# Altium schematic sheet GSM.SchDoc
size A3
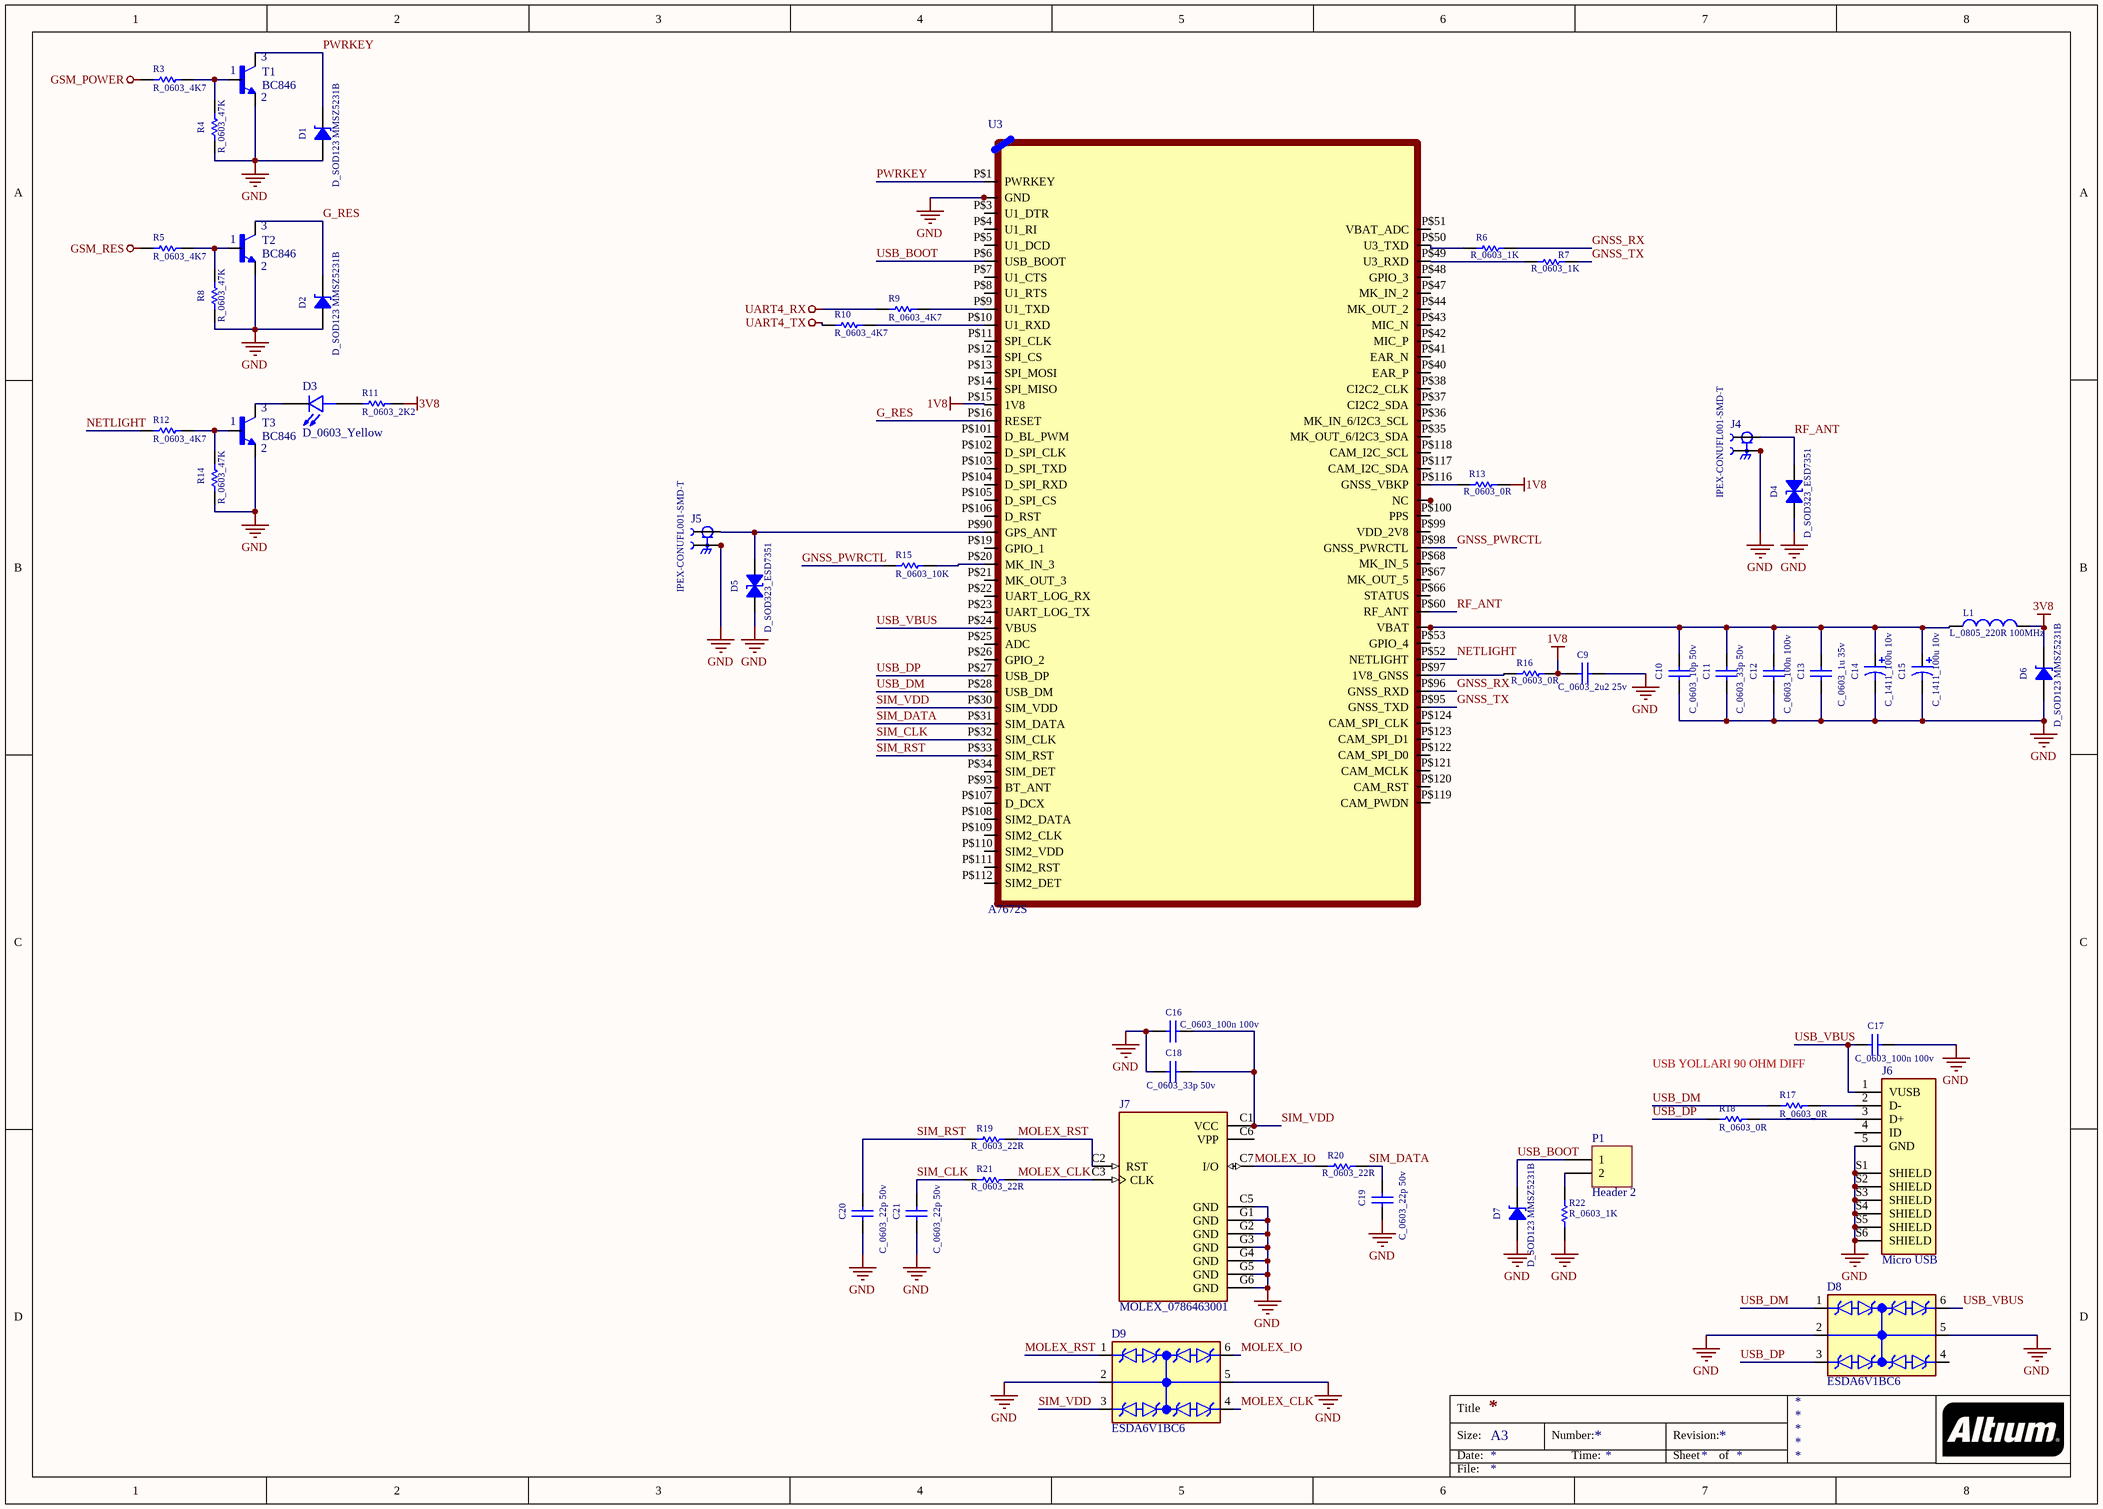
[diagram p0: GSM.SchDoc]

## Parts
C9  C_0603_2u2 25v  [CAP 0603]
C10  C_0603_10p 50v  [CAP 0603]
C11  C_0603_33p 50v  [CAP 0603]
C12  C_0603_100n 100v  [CAP 0603]
C13  C_0603_1u 35v  [CAP 0603]
C14  C_1411_100u 10v  [CAP 1411 TAN]
C15  C_1411_100u 10v  [CAP 1411 TAN]
C16  C_0603_100n 100v  [CAP 0603]
C17  C_0603_100n 100v  [CAP 0603]
C18  C_0603_33p 50v  [CAP 0603]
C19  C_0603_22p 50v  [CAP 0603]
C20  C_0603_22p 50v  [CAP 0603]
C21  C_0603_22p 50v  [CAP 0603]
D1  D_SOD123 MMSZ5231B  [SOD-123]
D2  D_SOD123 MMSZ5231B  [SOD-123]
D3  D_0603_Yellow  [Led 0603]
D4  D_SOD323_ESD7351  [SOD323]
D5  D_SOD323_ESD7351  [SOD323]
D6  D_SOD123 MMSZ5231B  [SOD-123]
D7  D_SOD123 MMSZ5231B  [SOD-123]
D8  ESDA6V1BC6  [SOT23-6]
D9  ESDA6V1BC6  [SOT23-6]
J4  IPEX-CONUFL001-SMD-T  [IPEX_LINX_CONUFL001-SMD-T]
J5  IPEX-CONUFL001-SMD-T  [IPEX_LINX_CONUFL001-SMD-T]
J6  Micro USB  [Micro USB]
J7  MOLEX_0786463001  [MOLEX_0786463001]
L1  L_0805_220R 100MHz  [Inductor 0805]
P1  Header 2  [HDR1X2]
R3  R_0603_4K7  [RES 0603]
R4  R_0603_47K  [RES 0603]
R5  R_0603_4K7  [RES 0603]
R6  R_0603_1K  [RES 0603]
R7  R_0603_1K  [RES 0603]
R8  R_0603_47K  [RES 0603]
R9  R_0603_4K7  [RES 0603]
R10  R_0603_4K7  [RES 0603]
R11  R_0603_2K2  [RES 0603]
R12  R_0603_4K7  [RES 0603]
R13  R_0603_0R  [RES 0603]
R14  R_0603_47K  [RES 0603]
R15  R_0603_10K  [RES 0603]
R16  R_0603_0R  [RES 0603]
R17  R_0603_0R  [RES 0603]
R18  R_0603_0R  [RES 0603]
R19  R_0603_22R  [RES 0603]
R20  R_0603_22R  [RES 0603]
R21  R_0603_22R  [RES 0603]
R22  R_0603_1K  [RES 0603]
T1  BC846  [SOT23]
T2  BC846  [SOT23]
T3  BC846  [SOT23]
U3  A7672S  [A7672S]

## Nets
1V8: C9.1 R13.1 R16.1 U3.P$15(1V8)
3V8: D6.2 L1.2 R11.2
GND: C9.2 C10.1 C11.1 C12.1 C13.2 C14.2 C15.2 C16.2 C17.1 C18.2 C19.2 C20.2 C21.2 D1.1 D2.1 D4.1 D5.1 D6.1 D7.1 D8.2(CC1) D8.5(CC2) D9.2(CC1) D9.5(CC2) J4.2 J4.3 J5.2 J5.3 J6.5(GND) J6.S1(SHIELD) J6.S2(SHIELD) J6.S3(SHIELD) J6.S4(SHIELD) J6.S5(SHIELD) J6.S6(SHIELD) J7.C5(GND) J7.G1(GND) J7.G2(GND) J7.G3(GND) J7.G4(GND) J7.G5(GND) J7.G6(GND) R4.2 R8.2 R14.2 R22.2 T1.2(E) T2.2(E) T3.2(E) U3.P$2(GND) U3.P$17(GND) U3.P$18(GND) U3.P$29(GND) U3.P$39(GND) U3.P$45(GND) U3.P$46(GND) U3.P$54(GND) U3.P$58(GND) U3.P$59(GND) U3.P$61(GND) U3.P$62(GND) U3.P$63(GND) U3.P$64(GND) U3.P$65(GND) U3.P$69(GND) U3.P$70(GND) U3.P$71(GND) U3.P$72(GND) U3.P$73(GND) U3.P$74(GND) U3.P$75(GND) U3.P$76(GND) U3.P$77(GND) U3.P$78(GND) U3.P$79(GND) U3.P$80(GND) U3.P$81(GND) U3.P$82(GND) U3.P$83(GND) U3.P$84(GND) U3.P$85(GND) U3.P$86(GND) U3.P$87(GND) U3.P$88(GND) U3.P$89(GND) U3.P$91(GND) U3.P$92(GND) U3.P$94(GND)
GSM_POWER: R3.2
GSM_RES: R5.2
UART4_RX: R9.2
UART4_TX: R10.2
G_RES: D2.2 T2.3(C) U3.P$16(RESET)
GNSS_PWRCTL: R15.2 U3.P$98(GNSS_PWRCTL)
GNSS_RX: R6.1 U3.P$96(GNSS_RXD)
GNSS_TX: R7.1 U3.P$95(GNSS_TXD)
MOLEX_CLK: D9.4(C3) J7.C3(CLK) R21.1
MOLEX_IO: D9.6(C4) J7.C7(I/O) R20.2
MOLEX_RST: D9.1(C1) J7.C2(RST) R19.1
NETLIGHT: R12.2 U3.P$52(NETLIGHT)
PWRKEY: D1.2 T1.3(C) U3.P$1(PWRKEY)
RF_ANT: D4.2 J4.1 U3.P$60(RF_ANT)
SIM_CLK: C21.1 R21.2 U3.P$32(SIM_CLK)
SIM_DATA: C19.1 R20.1 U3.P$31(SIM_DATA)
SIM_RST: C20.1 R19.2 U3.P$33(SIM_RST)
SIM_VDD: C16.1 C18.1 D9.3(C2) J7.C1(VCC) U3.P$30(SIM_VDD)
USB_BOOT: D7.2 P1.1 U3.P$6(USB_BOOT)
USB_DM: D8.1(C1) R17.2 U3.P$28(USB_DM)
USB_DP: D8.3(C2) R18.2 U3.P$27(USB_DP)
USB_VBUS: C17.2 D8.6(C4) J6.1(VUSB) U3.P$24(VBUS)
NetC10_2: C10.2 C11.2 C12.2 C13.1 C14.1 C15.1 L1.1 U3.P$55(VBAT) U3.P$56(VBAT) U3.P$57(VBAT)
NetD3_1: D3.1(A) R11.1
NetD3_2: D3.2(C) T3.3(C)
NetD5_2: D5.2 J5.1 U3.P$90(GPS_ANT)
NetJ6_2: J6.2(D-) R17.1
NetJ6_3: J6.3(D+) R18.1
NetP1_2: P1.2 R22.1
NetR3_1: R3.1 R4.1 T1.1(B)
NetR5_1: R5.1 R8.1 T2.1(B)
NetR6_2: R6.2 U3.P$50(U3_TXD)
NetR7_2: R7.2 U3.P$49(U3_RXD)
NetR9_1: R9.1 U3.P$9(U1_TXD)
NetR10_1: R10.1 U3.P$10(U1_RXD)
NetR12_1: R12.1 R14.1 T3.1(B)
NetR13_2: R13.2 U3.P$116(GNSS_VBKP)
NetR15_1: R15.1 U3.P$20(MK_IN_3)
NetR16_2: R16.2 U3.P$97(1V8_GNSS)
NetU3_P$113: U3.P$113(NC) U3.P$114(NC) U3.P$115(NC)

Not connected (* = marked no-connect by the designer): D8 4(C3); J6 4(ID); J7 C6(VPP); U3 P$3(U1_DTR) P$4(U1_RI) P$5(U1_DCD) P$7(U1_CTS) P$8(U1_RTS) P$11(SPI_CLK) P$12(SPI_CS) P$13(SPI_MOSI) P$14(SPI_MISO) P$19(GPIO_1) P$21(MK_OUT_3) P$22(UART_LOG_RX) P$23(UART_LOG_TX) P$25(ADC) P$26(GPIO_2) P$34(SIM_DET) P$35(MK_OUT_6/I2C3_SDA) P$36(MK_IN_6/I2C3_SCL) P$37(CI2C2_SDA) P$38(CI2C2_CLK) P$40(EAR_P) P$41(EAR_N) P$42(MIC_P) P$43(MIC_N) P$44(MK_OUT_2) P$47(MK_IN_2) P$48(GPIO_3) P$51(VBAT_ADC) P$53(GPIO_4) P$66(STATUS) P$67(MK_OUT_5) P$68(MK_IN_5) P$93(BT_ANT) P$99(VDD_2V8) P$100(PPS) P$101(D_BL_PWM) P$102(D_SPI_CLK) P$103(D_SPI_TXD) P$104(D_SPI_RXD) P$105(D_SPI_CS) P$106(D_RST) P$107(D_DCX) P$108(SIM2_DATA) P$109(SIM2_CLK) P$110(SIM2_VDD) P$111(SIM2_RST) P$112(SIM2_DET) P$117(CAM_I2C_SDA) P$118(CAM_I2C_SCL) P$119(CAM_PWDN) P$120(CAM_RST) P$121(CAM_MCLK) P$122(CAM_SPI_D0) P$123(CAM_SPI_D1) P$124(CAM_SPI_CLK)

## Notes on the sheet
- USB YOLLARI 90 OHM DIFF
- Title
- Size:
- Date:
- A3
- Number:
- Time:
- Revision:
- Sheet
- of
- File:

## Library data of the parts
C9-C13 C16-C21 = Cap: Capacitor; Published: 8-Jun-2000; LatestRevisionDate: 17-Jul-2002; LatestRevisionNote: Re-released for DXP Platform.; Publisher: Altium Limited
C14 C15 = Cap Tantalium: Capacitor Tantalium; Published: 8-Jun-2000; LatestRevisionDate: 17-Jul-2002; LatestRevisionNote: Re-released for DXP Platform.; Publisher: Altium Limited
D1 D2 D6 D7 = Diode Zener: Zener Diode
D3 = Led: MP: SML-D12FWT86; MF: Rohm; Price: None; Availability: In Stock; Package: 0603 Rohm; SnapEDA_Link: https://www.snapeda.com/parts/SML-D12FWT86/Rohm/view-part/?ref=snap; Check_prices: https://www.snapeda.com/parts/SML-D12FWT86/Rohm/view-part/?ref=eda; Value: *; Purchase-URL: https://pricing.snapeda.com/search/part/SML-D12FWT86/?ref=eda
D4 D5 = Diode TVS: Zener Diode
D8 D9 = ESDA6V1BC6: - Clamp - Ipp Tvs Diode Surface Mount SOT-23-6; MF: STMicroelectronics; Check_prices: https://www.snapeda.com/parts/ESDA6V1BC6/STMicroelectronics/view-part/?ref=eda; Price: None; MP: ESDA6V1BC6; Purchase-URL: https://pricing.snapeda.com/search/part/ESDA6V1BC6/?ref=eda; SnapEDA_Link: https://www.snapeda.com/parts/ESDA6V1BC6/STMicroelectronics/view-part/?ref=snap; Availability: In Stock; Package: SOT-23-6 STMicroelectronics; Value: *
J4 J5 = IPEX-CONUFL001-SMD-T: U.FL (UMCC) Connector Jack, Male Pin 50Ohm Surface Mount Solder; MF: Linx; Price: None; MP: CONUFL001-SMD-T; Package: None; Value: *; Check_prices: https://www.snapeda.com/parts/CONUFL001-SMD-T/Linx/view-part/?ref=eda; Availability: Unavailable; SnapEDA_Link: https://www.snapeda.com/parts/CONUFL001-SMD-T/Linx/view-part/?ref=snap
J6 = Micro USB: Micro USB 2.0, Input Output Connectors, B TYPE RECEPTACLE; MP: 10118193-0001LF; MF: Amphenol ICC; Value: *; Package: None; Check_prices: https://www.snapeda.com/parts/10118193-0001LF/Amphenol+FCI/view-part/?ref=eda; Purchase-URL: https://pricing.snapeda.com/search/part/10118193-0001LF/?ref=eda; Price: None; Availability: In Stock; SnapEDA_Link: https://www.snapeda.com/parts/10118193-0001LF/Amphenol+FCI/view-part/?ref=snap
J7 = MOLEX_0786463001: 6 Position Card Connector Micro SIM Surface Mount, Right Angle Gold; MF: Molex; Check_prices: https://www.snapeda.com/parts/0786463001/Molex/view-part/?ref=eda; SnapEDA_Link: https://www.snapeda.com/parts/0786463001/Molex/view-part/?ref=snap; Value: *; Purchase-URL: https://pricing.snapeda.com/search/part/0786463001/?ref=eda; Availability: In Stock; Price: None; MP: 0786463001; Package: None
L1 = Inductor: PCB_Layout: Complies with manufacturer's recommendation.; Published: 26-Sep-2008; DatasheetVersion: Mar-2008; PackageVersion: Mar-2008; PackageReference: B82462G4; Publisher: Altium Limited; PackageDescription: SM Power Inductor; 2 Leads; Body 6.3 x 6.3 x 3.0 mm (LxWxH); ComponentLink1Description: Manufacturer Link; ComponentLink1URL: http://www.epcos.com/; ComponentLink2Description: Datasheet; ComponentLink2URL: http://www.epcos.com/inf/30/db/ind_2008/b82462g4.pdf
P1 = Header 2: Header, 2-Pin; LatestRevisionDate: 17-Jul-2002; LatestRevisionNote: Re-released for DXP Platform.; Publisher: Altium Limited
R3-R22 = Res: Resistor; Published: 8-Jun-2000; LatestRevisionDate: 17-Jul-2002; LatestRevisionNote: Re-released for DXP Platform.; Publisher: Altium Limited
T1-T3 = BC846: TRANSISTOR, NPN, 0.1A, 65V, SOT23; Transistor Polarity:NPN; Collector Emitter Voltage V(br)ceo:65V; Transition Frequency Typ ft:100MHz; Power Dissipation Pd:250mW; DC Collector Current:100mA; DC Current Gain hFE:110; Operating Temperature Min:-55Â°C; Operating Temperature Max:150Â°C; Transistor Case Style:SOT-23; No. of Pins:3; DC Current Gain Hfe Max:450; Operating Temperature Range:-55Â°C to +150Â°C; MF: ON Semiconductor; MP: BC846; Value: *; SnapEDA_Link: https://www.snapeda.com/parts/BC846/Onsemi/view-part/?ref=snap; Availability: In Stock; Purchase-URL: https://pricing.snapeda.com/search/part/BC846/?ref=eda; Package: SOT-23-3 Panasonic Electronic; Price: None; Check_prices: https://www.snapeda.com/parts/BC846/Onsemi/view-part/?ref=eda
U3 = A7672S: LTE Cat 1 Module On Module 10Mbps 700MHz/800MHz/900MHz/1700MHz/1800MHz/1900MHz/2100MHz 33dBm 3.4V to 4.2V -109dBm; MF: SIMCom; Check_prices: https://www.snapeda.com/parts/A7672S/SIMCom/view-part/?ref=eda; Value: *; Availability: Not in stock; Price: None; Package: Package; MP: A7672S; SnapEDA_Link: https://www.snapeda.com/parts/A7672S/SIMCom/view-part/?ref=snap